# EAGLE design chip-z8530-rs422_split_a (EAGLE 9.3.0)
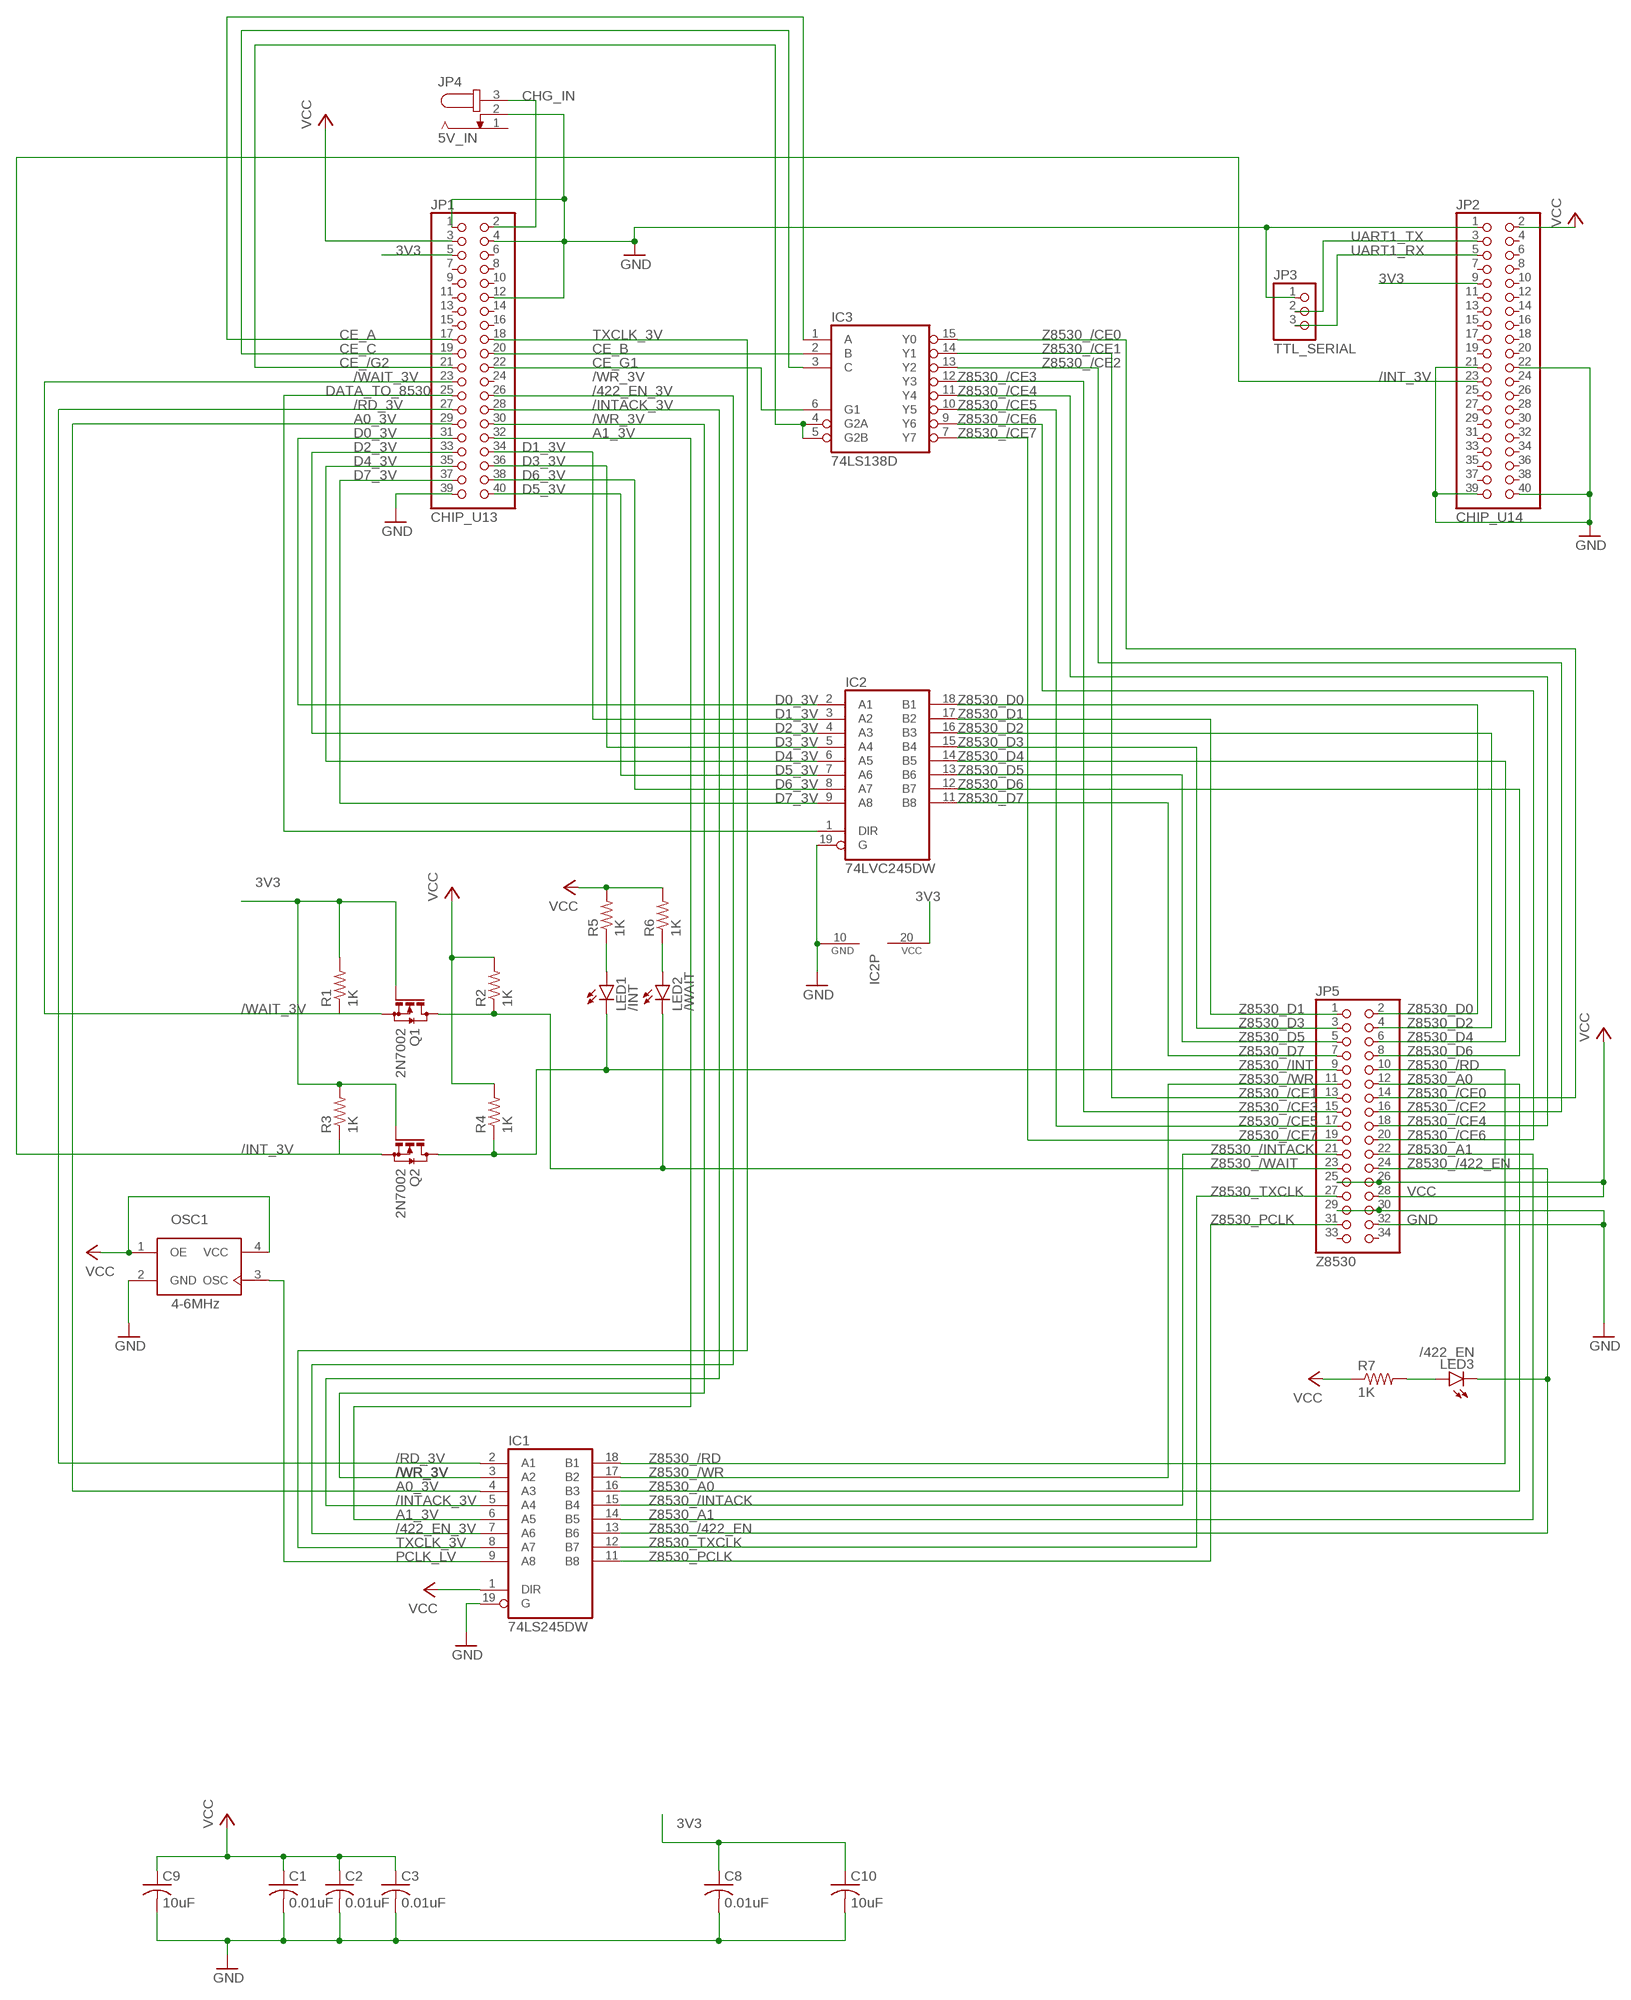
[diagram p0: schematic, sheet 1]

## Parts
C1  0.01uF  C-USC0805  [C0805]
C2  0.01uF  C-USC0805  [C0805]
C3  0.01uF  C-USC0805  [C0805]
C8  0.01uF  C-USC0805  [C0805]
C9  10uF  C-USC0805  [C0805]
C10  10uF  C-USC0805  [C0805]
IC1  74LS245DW  [SO20W]
IC2  74LVC245DW  74LS245DW  [SO20W]
IC3  74LS138D  [SO16]
JP1  CHIP_U13  PINHD-2X20  [2X20]
JP2  CHIP_U14  PINHD-2X20  [2X20]
JP3  TTL_SERIAL  PINHD-1X3/90  [1X03/90]
JP4  5V_IN  JACK-PLUG1  [SPC4078]
JP5  Z8530  PINHD-2X17  [2X17]
LED1  /INT  LED3MM  [LED3MM]
LED2  /WAIT  LED3MM  [LED3MM]
LED3  /422_EN  LED3MM  [LED3MM]
OSC1  4-6MHz  XO-SMD  [SG5032]
Q1  2N7002  BSS123  [SOT23]
Q2  2N7002  BSS123  [SOT23]
R1  1K  R-US_R0805  [R0805]
R2  1K  R-US_R0805  [R0805]
R3  1K  R-US_R0805  [R0805]
R4  1K  R-US_R0805  [R0805]
R5  1K  R-US_R0805  [R0805]
R6  1K  R-US_R0805  [R0805]
R7  1K  R-US_R0805  [R0805]

## Nets
3V3 [3Vpwr]: C8.1 C10.1 IC2.20(VCC) JP1.5 JP2.9 Q1.1(G) Q2.1(G) R1.2 R3.2
/422_EN_3V: IC1.7(A6) JP1.26
/INT_3V: JP2.23 Q2.2(S) R3.1
/INTACK_3V: IC1.5(A4) JP1.28
/RD_3V: IC1.2(A1) JP1.27
/WAIT_3V: JP1.23 Q1.2(S) R1.1
/WR_3V: IC1.3(A2) JP1.30
A0_3V: IC1.4(A3) JP1.29
A1_3V: IC1.6(A5) JP1.32
CE_/G2: IC3.4(G2A) IC3.5(G2B) JP1.21
CE_A: IC3.1(A) JP1.17
CE_B: IC3.2(B) JP1.20
CE_C: IC3.3(C) JP1.19
CE_G1: IC3.6(G1) JP1.22
CHG_IN [gnd]: JP1.2 JP4.3
D0_3V: IC2.2(A1) JP1.31
D1_3V: IC2.3(A2) JP1.34
D2_3V: IC2.4(A3) JP1.33
D3_3V: IC2.5(A4) JP1.36
D4_3V: IC2.6(A5) JP1.35
D5_3V: IC2.7(A6) JP1.40
D6_3V: IC2.8(A7) JP1.38
D7_3V: IC2.9(A8) JP1.37
DATA_TO_8530: IC2.1(DIR) JP1.25
GND [gnd]: C1.2 C2.2 C3.2 C8.2 C9.2 C10.2 IC1.19(G) IC2.10(GND) IC2.19(G) JP1.1 JP1.4 JP1.12 JP1.39 JP2.1 JP2.21 JP2.22 JP2.39 JP2.40 JP3.1 JP4.2 JP5.29 JP5.30 JP5.32 OSC1.2(GND)
N$1: LED1.A R5.1
N$2: LED2.A R6.1
N$3: LED3.A R7.2
PCLK_LV: IC1.9(A8) OSC1.3(OSC)
TXCLK_3V: IC1.8(A7) JP1.18
UART1_RX: JP2.5 JP3.3
UART1_TX: JP2.3 JP3.2
VCC [5Vpwr]: C1.1 C2.1 C3.1 C9.1 IC1.1(DIR) JP1.3 JP2.2 JP5.25 JP5.26 JP5.28 OSC1.1(OE) OSC1.4(VCC) R2.2 R4.2 R5.2 R6.2 R7.1
Z8530_/422_EN: IC1.13(B6) JP5.24 LED3.K(C)
Z8530_/CE0: IC3.15(Y0) JP5.14
Z8530_/CE1: IC3.14(Y1) JP5.13
Z8530_/CE2: IC3.13(Y2) JP5.16
Z8530_/CE3: IC3.12(Y3) JP5.15
Z8530_/CE4: IC3.11(Y4) JP5.18
Z8530_/CE5: IC3.10(Y5) JP5.17
Z8530_/CE6: IC3.9(Y6) JP5.20
Z8530_/CE7: IC3.7(Y7) JP5.19
Z8530_/INT: JP5.9 LED1.K(C) Q2.3(D) R4.1
Z8530_/INTACK: IC1.15(B4) JP5.21
Z8530_/RD: IC1.18(B1) JP5.10
Z8530_/WAIT: JP5.23 LED2.K(C) Q1.3(D) R2.1
Z8530_/WR: IC1.17(B2) JP5.11
Z8530_A0: IC1.16(B3) JP5.12
Z8530_A1: IC1.14(B5) JP5.22
Z8530_D0: IC2.18(B1) JP5.2
Z8530_D1: IC2.17(B2) JP5.1
Z8530_D2: IC2.16(B3) JP5.4
Z8530_D3: IC2.15(B4) JP5.3
Z8530_D4: IC2.14(B5) JP5.6
Z8530_D5: IC2.13(B6) JP5.5
Z8530_D6: IC2.12(B7) JP5.8
Z8530_D7: IC2.11(B8) JP5.7
Z8530_PCLK: IC1.11(B8) JP5.31
Z8530_TXCLK: IC1.12(B7) JP5.27
Unconnected: JP1.6 JP1.7 JP1.8 JP1.9 JP1.10 JP1.11 JP1.13 JP1.14 JP1.15 JP1.16 JP1.24 JP2.4 JP2.6 JP2.7 JP2.8 JP2.10 JP2.11 JP2.12 JP2.13 JP2.14 JP2.15 JP2.16 JP2.17 JP2.18 JP2.19 JP2.20 JP2.24 JP2.25 JP2.26 JP2.27 JP2.28 JP2.29 JP2.30 JP2.31 JP2.32 JP2.33 JP2.34 JP2.35 JP2.36 JP2.37 JP2.38 JP4.1 JP5.33 JP5.34

## Power pins joined to a net without a drawn wire
GND: IC1.10(GND) IC3.8(GND)
VCC: IC1.20(VCC) IC3.16(VCC)

## Library data of the parts
C1-C3 C8-C10 = rcl:C-US: CAPACITOR, American symbol; SPICEPREFIX: C
IC1 IC2 = 74xx-us:74*245: Octal BUS TRANSCEIVER, 3-state
IC3 = 74xx-us:74*138: 3-line to 8-line DECODER/DEMULTIPLEXER
JP1 JP2 = pinhead:PINHD-2X20: PIN HEADER
JP3 = pinhead:PINHD-1X3: PIN HEADER
JP4 = con-jack:JACK-PLUG: DC POWER JACK Power Jack, DC, Right Angle, Through Hole, Rated 5A at 16VDC, PC Terminals Distributor: Farnell (www.Farnell.de) Drawing: 84N1161.pdf / 84N1162.pdf Manufacturer: SPC Technology (www.spctechnology.com) Type: SPC4077 / SPC 4078; OC_FARNELL: unknown; OC_NEWARK: unknown
JP5 = pinhead:PINHD-2X17: PIN HEADER
LED1-LED3 = led:LED: LED OSRAM: - CHIPLED LG R971, LG N971, LY N971, LG Q971, LY Q971, LO R971, LY R971 LH N974, LH R974 LS Q976, LO Q976, LY Q976 LO Q996 - Hyper CHIPLED LW Q18S LB Q993, LB Q99A, LB R99A - SideLED LS A670, LO A670, LY A670, LG A670, LP A670 LB A673, LV A673, LT A673, LW A673 LH A674 LY A675 LS A676, LA A676, LO A676, LY A676, LW A676 LS A679, LY A679, LG A679 - Hyper Micro SIDELED® LS Y876, LA Y876, LO Y876, LY Y876 LT Y87S - SmartLED LW L88C, LW L88S LB L89C, LB L89S, LG L890 LS L89K, LO L89K, LY L89K LS L896, LA L896, LO L896, LY L896 - TOPLED LS T670, LO T670, LY T670, LG T670, LP T670 LSG T670, LSP T670, LSY T670, LOP T670, LYG T670 LG T671, LOG T671, LSG T671 LB T673, LV T673, LT T673, LW T673 LH T674 LS T676, LA T676, LO T676, LY T676, LB T676, LH T676, LSB T676, LW T676 LB T67C, LV T67C, LT T67C, LS T67K, LO T67K, LY T67K, LW E67C LS E67B, LA E67B, LO E67B, LY E67B, LB E67C, LV E67C, LT E67C LW T67C LS T679, LY T679, LG T679 LS T770, LO T770, LY T770, LG T770, LP T770 LB T773, LV T773, LT T773, LW T773 LH T774 LS E675, LA E675, LY E675, LS T675 LS T776, LA T776, LO T776, LY T776, LB T776 LHGB T686 LT T68C, LB T68C - Hyper Mini TOPLED® LB M676 - Mini TOPLED Santana® LG M470 LS M47K, LO M47K, LY M47K Source: http://www.osram.convergy.de LUXEON: - LUMILED® LXK2-PW12-R00, LXK2-PW12-S00, LXK2-PW14-U00, LXK2-PW14-V00 LXK2-PM12-R00, LXK2-PM12-S00, LXK2-PM14-U00 LXK2-PE12-Q00, LXK2-PE12-R00, LXK2-PE12-S00, LXK2-PE14-T00, LXK2-PE14-U00 LXK2-PB12-K00, LXK2-PB12-L00, LXK2-PB12-M00, LXK2-PB14-N00, LXK2-PB14-P00, LXK2-PB14-Q00 LXK2-PR12-L00, LXK2-PR12-M00, LXK2-PR14-Q00, LXK2-PR14-R00 LXK2-PD12-Q00, LXK2-PD12-R00, LXK2-PD12-S00 LXK2-PH12-R00, LXK2-PH12-S00 LXK2-PL12-P00, LXK2-PL12-Q00, LXK2-PL12-R00 Source: www.luxeon.com KINGBRIGHT: KA-3528ASYC Source: www.kingbright.com
OSC1 = rs422-stuff:XO-SMD: Surface mount xtal oscillator in SG5032 package
Q1 Q2 = transistor-small-signal:BSS123: N-CHANNEL MOS FET
R1-R7 = rcl:R-US_: RESISTOR, American symbol; SPICEPREFIX: R

## Net classes
0 default: width 0.254 mm, clearance 0.254 mm
1 3Vpwr: width 0.305 mm, clearance 0.254 mm
2 5Vpwr: width 0.406 mm, clearance 0.254 mm
3 gnd: width 0.508 mm, clearance 0.254 mm

## Board
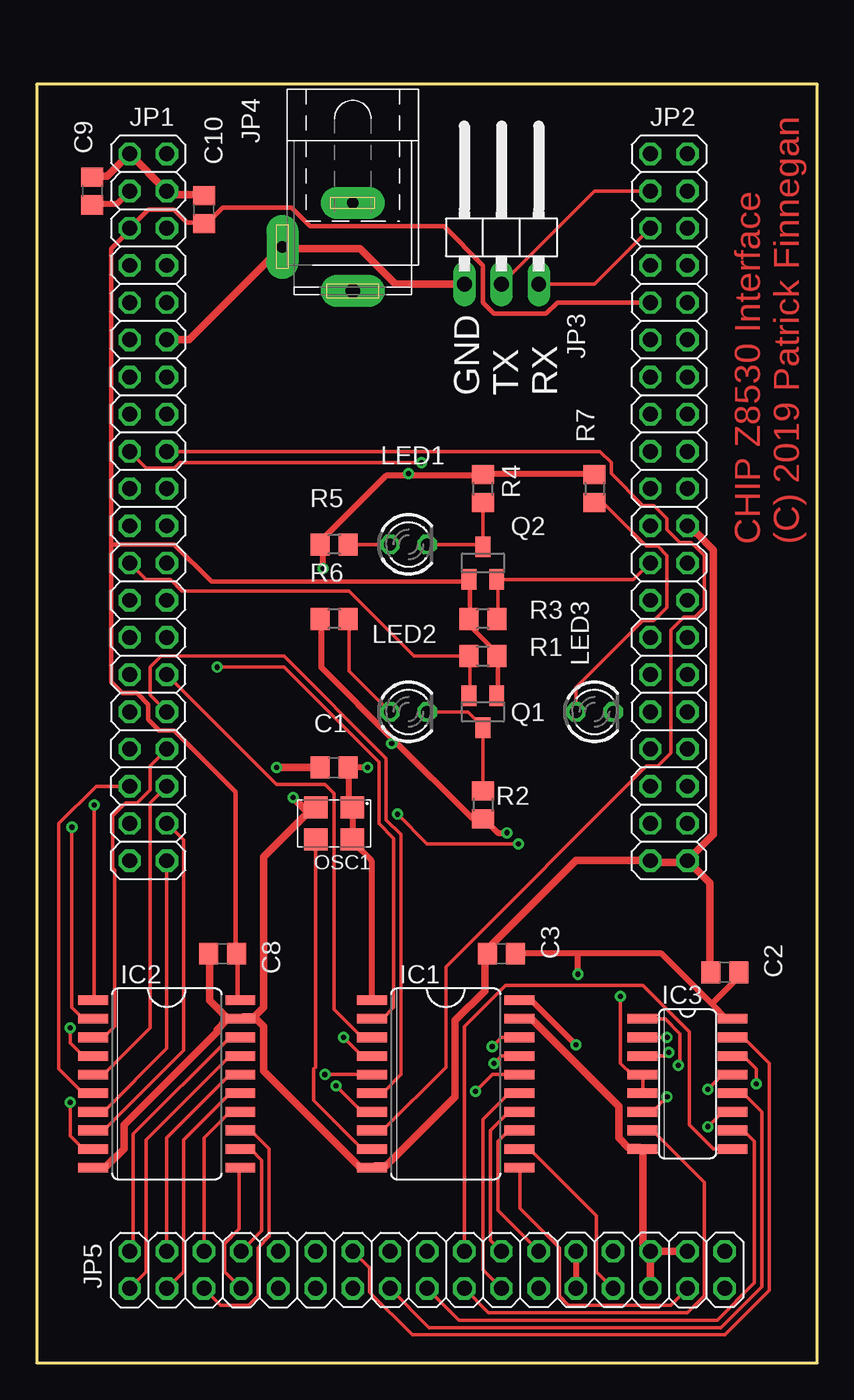
[diagram p1: board, top side]
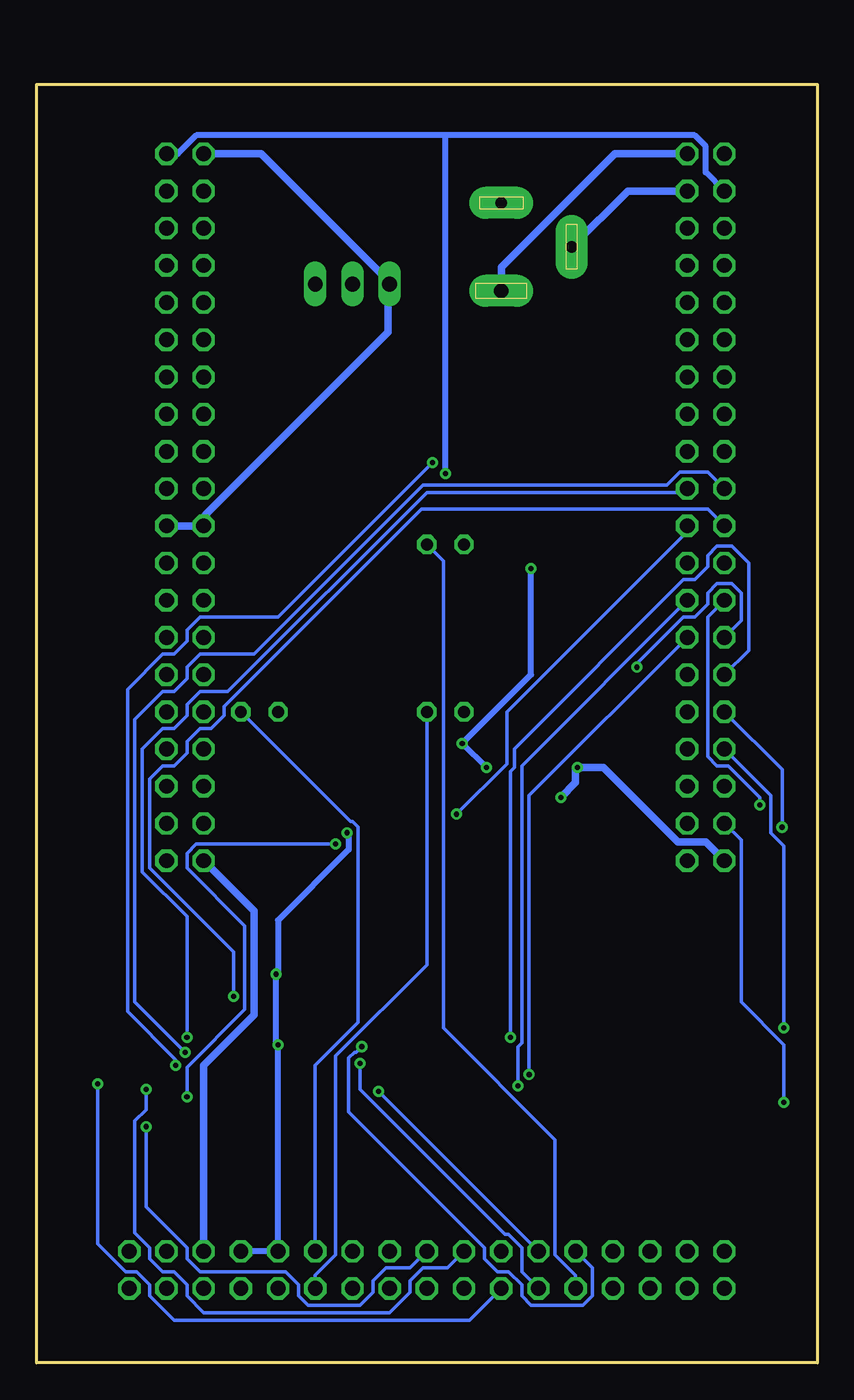
[diagram p2: board, bottom side, seen from below]

Size 53.32 x 87.3 mm. Coordinates in mm from the lower left corner, seen from the top.
Outline: 0,0 53.32,0 53.32,87.3 0,87.3 0,0
Copper layers (1*16): Top 0.035mm / dielectric 1.5mm / Bottom 0.035mm
Design rules "8mil": minimum track width 6mil, minimum drill 0.35mm, track to track 8mil, track to pad 8mil, pad to pad 8mil, via to via 8mil, smd to smd 8mil, copper to edge 40mil, drill to drill 6mil, minimum pad ring 10mil, minimum via ring 8mil, stop-mask expansion 4mil, vias tented up to drill 0mil, thermal gap 10mil

### Footprints (pad centres in the part's own frame; a part is rotated, then mirrored left to right if it is on the bottom)
C0805 = smd 1.3 x 1.5: 1 -0.95,0; 2 0.95,0
SO20W = smd 0.66 x 2.032: 1 -5.715,-5.029; 2 -4.445,-5.029; 3 -3.175,-5.029; 4 -1.905,-5.029; 5 -0.635,-5.029; 6 0.635,-5.029; 7 1.905,-5.029; 8 3.175,-5.029; 9 4.445,-5.029; 10 5.715,-5.029; 11 5.715,5.029; 12 4.445,5.029; 13 3.175,5.029; 14 1.905,5.029; 15 0.635,5.029; 16 -0.635,5.029; 17 -1.905,5.029; 18 -3.175,5.029; 19 -4.445,5.029; 20 -5.715,5.029
SO16 = smd 0.66 x 2.032: 1 -4.445,-3.073; 2 -3.175,-3.073; 3 -1.905,-3.073; 4 -0.635,-3.073; 5 0.635,-3.073; 6 1.905,-3.073; 7 3.175,-3.073; 8 4.445,-3.073; 9 4.445,3.073; 10 3.175,3.073; 11 1.905,3.073; 12 0.635,3.073; 13 -0.635,3.073; 14 -1.905,3.073; 15 -3.175,3.073; 16 -4.445,3.073
2X20 = drill 1.016 octagon: 1 -24.13,-1.27; 2 -24.13,1.27; 3 -21.59,-1.27; 4 -21.59,1.27; 5 -19.05,-1.27; 6 -19.05,1.27; 7 -16.51,-1.27; 8 -16.51,1.27; 9 -13.97,-1.27; 10 -13.97,1.27; 11 -11.43,-1.27; 12 -11.43,1.27; 13 -8.89,-1.27; 14 -8.89,1.27; 15 -6.35,-1.27; 16 -6.35,1.27; 17 -3.81,-1.27; 18 -3.81,1.27; 19 -1.27,-1.27; 20 -1.27,1.27; 21 1.27,-1.27; 22 1.27,1.27; 23 3.81,-1.27; 24 3.81,1.27; 25 6.35,-1.27; 26 6.35,1.27; 27 8.89,-1.27; 28 8.89,1.27; 29 11.43,-1.27; 30 11.43,1.27; 31 13.97,-1.27; 32 13.97,1.27; 33 16.51,-1.27; 34 16.51,1.27; 35 19.05,-1.27; 36 19.05,1.27; 37 21.59,-1.27; 38 21.59,1.27; 39 24.13,-1.27; 40 24.13,1.27
1X03/90 = drill 1.016 long: 1 -2.54,-3.81; 2 0,-3.81; 3 2.54,-3.81
SPC4078 = drill 0.8 pad 2.184 long: 1 -3,0; 2 0,-4.8 | drill 1 pad 2.184 long: 3 3,0
2X17 = drill 1.016 octagon: 1 -20.32,-1.27; 2 -20.32,1.27; 3 -17.78,-1.27; 4 -17.78,1.27; 5 -15.24,-1.27; 6 -15.24,1.27; 7 -12.7,-1.27; 8 -12.7,1.27; 9 -10.16,-1.27; 10 -10.16,1.27; 11 -7.62,-1.27; 12 -7.62,1.27; 13 -5.08,-1.27; 14 -5.08,1.27; 15 -2.54,-1.27; 16 -2.54,1.27; 17 0,-1.27; 18 0,1.27; 19 2.54,-1.27; 20 2.54,1.27; 21 5.08,-1.27; 22 5.08,1.27; 23 7.62,-1.27; 24 7.62,1.27; 25 10.16,-1.27; 26 10.16,1.27; 27 12.7,-1.27; 28 12.7,1.27; 29 15.24,-1.27; 30 15.24,1.27; 31 17.78,-1.27; 32 17.78,1.27; 33 20.32,-1.27; 34 20.32,1.27
LED3MM = drill 0.813 octagon: A -1.27,0; K 1.27,0
SG5032 = smd 1.6 x 1.5: 1 -1.25,-1.1; 2 1.25,-1.1; 3 1.25,1.1; 4 -1.25,1.1
SOT23 = smd 1 x 1.4: 1 -0.95,-1.1; 2 0.95,-1.1; 3 0,1.1
R0805 = smd 1.3 x 1.5: 1 -0.95,0; 2 0.95,0

### Placement (x,y rotation side)
C1  20.32,40.64 180 top
C2  46.99,26.67 180 top
C3  31.75,27.94 180 top
C8  12.7,27.94 180 top
C9  3.81,80.01 90 top
C10  11.43,78.74 90 top
IC1  27.94,19.05 270 top
IC2  8.89,19.05 270 top
IC3  44.45,19.05 270 top
JP1  7.62,58.42 270 top
JP2  43.18,58.42 270 top
JP3  31.75,77.47 0 top
JP4  21.59,76.2 270 top
JP5  26.67,6.35 0 top
LED1  25.4,55.88 0 top
LED2  25.4,44.45 0 top
LED3  38.1,44.45 0 top
OSC1  20.32,36.83 180 top
Q1  30.48,44.45 180 top
Q2  30.48,54.61 0 top
R1  30.48,48.26 0 top
R2  30.48,38.1 270 top
R3  30.48,50.8 180 top
R4  30.48,59.69 90 top
R5  20.32,55.88 180 top
R6  20.32,50.8 180 top
R7  38.1,59.69 270 top

### Tracks (layer width: path | path; a pad name or v marks a point on that pad's centre or on a via)
3V3
  Top 0.305: Q1.1 31.5,45.59 31.5,48.26 R1.2 31.5,48.39 29.59,50.29 29.59,50.67 R3.2 29.59,50.8 29.59,53.47 Q2.1 29.46,53.34 11.94,53.34 9.4,55.88 5.08,55.88 | IC2.20 13.84,24.77 13.72,24.89 13.72,27.94 C8.1 13.59,28.07 13.59,38.99 9.4,43.18 8.38,43.18 7.62,43.94 7.62,44.96 6.86,45.72 5.84,45.72 5.08,46.48 5.08,55.88 | 5.08,55.88 5.08,76.07 6.35,77.34 JP1.5 7.62,78.74 9.4,78.74 10.29,77.85 11.43,77.85 C10.1 11.56,77.72 12.7,78.87 17.4,78.87 18.67,77.6 27.81,77.6 30.48,74.93 30.48,72.39 31.24,71.63 34.8,71.63 35.56,72.39 JP2.9
/422_EN_3V  (via drill 0.35)
  Top 0.254: IC1.7 22.23,17.14 v20.45,18.92
  Bottom 0.254: v20.45,18.92 20.45,21.59 20.19,21.84 20.19,40.77 JP1.26
/INT_3V
  Top 0.254: R3.1 31.5,50.8 31.5,53.47 Q2.2 31.62,53.47 40.77,53.47 JP2.23
/INTACK_3V  (via drill 0.35)
  Top 0.254: v19.69,19.68 IC1.5
  Bottom 0.254: v19.69,19.68 19.69,38.73 JP1.28
/RD_3V  (via drill 0.35)
  Top 0.254: IC1.2 23.62,23.49 24.38,24.26 24.38,35.81 23.37,36.83 23.37,41.02 16.89,47.5 v12.32,47.5
  Bottom 0.254: v12.32,47.5 12.32,47.75 9.14,50.93 8.38,50.93 7.49,51.82 7.49,52.58 6.86,53.21 5.84,53.21 5.21,52.58 5.21,50.67 JP1.27
/WAIT_3V
  Top 0.254: Q1.2 29.59,45.59 29.59,48.26 R1.1 25.78,48.26 21.34,52.71 9.91,52.71 9.14,53.47 7.49,53.47 JP1.23
/WR_3V
  Top 0.254: IC1.3 22.23,22.23 20.32,24.13 20.32,38.86 19.69,39.5 16.38,39.5 JP1.30
A0_3V  (via drill 0.35)
  Top 0.254: IC1.4 22.23,20.95 v20.95,22.23
  Bottom 0.254: v20.95,22.23 20.95,40.39 20.7,40.64 20.7,41.91 9.14,53.47 8.38,53.47 7.49,54.36 7.49,55.12 6.86,55.75 5.84,55.75 4.7,54.61 4.7,48.64 JP1.29
A1_3V
  Top 0.254: IC1.6 23.62,18.41 24.89,19.68 24.89,36.07 23.88,37.08 23.88,41.27 16.89,48.26 8.51,48.26 7.75,47.5 7.75,45.59 JP1.32
CE_/G2  (via drill 0.35)
  Top 0.254: IC3.5 41.4,18.41 41.4,19.68 IC3.4 40.64,19.68 39.88,20.45 v39.88,25.02
  Bottom 0.254: v39.88,25.02 39.88,28.07 45.59,33.78 45.59,39.88 44.7,40.77 43.94,40.77 43.05,41.66 43.05,42.42 42.16,43.31 41.4,43.31 40.51,44.2 40.51,44.83 27.05,58.29 7.49,58.29 JP1.21
CE_A  (via drill 0.35)
  Top 0.254: IC3.1 42.93,23.49 43.94,22.48 43.94,20.45 v43.81,20.32 | v26.29,61.47 9.78,61.47 9.4,61.09 7.49,61.09 JP1.17
  Bottom 0.254: v43.81,20.32 43.81,20.7 47.12,24 47.12,45.97 44.7,48.39 43.94,48.39 43.05,49.28 43.05,50.04 42.16,50.93 36.83,50.93 v26.29,61.47
CE_B  (via drill 0.35)
  Top 0.254: v43.05,22.23 IC3.2
  Bottom 0.254: v43.05,22.23 43.05,30.48 46.1,33.53 46.1,41.91 44.7,43.31 43.94,43.31 43.05,44.2 43.05,44.96 42.16,45.85 40.26,45.85 26.67,59.44 9.14,59.44 JP1.20
CE_C  (via drill 0.35)
  Top 0.254: IC3.3 42.93,20.95 v43.18,21.21
  Bottom 0.254: v43.18,21.21 46.61,24.64 46.61,43.94 44.7,45.85 43.94,45.85 43.05,46.74 43.05,47.5 42.16,48.39 38.48,48.39 26.92,59.94 10.29,59.94 9.4,60.83 7.49,60.83 JP1.19
CE_G1  (via drill 0.35)
  Top 0.254: IC3.6 42.04,17.14 v43.05,18.16 | v32.89,35.43 26.67,35.43 v24.64,37.47
  Bottom 0.254: v43.05,18.16 43.05,20.19 39.12,24.13 39.12,29.84 43.05,33.78 43.05,34.8 42.42,35.43 v32.89,35.43 | v24.64,37.47 21.21,40.89 21.21,44.45 8.89,56.77 JP1.22
CHG_IN
  Bottom 0.508: JP1.2 13.84,82.55 21.59,74.8 JP4.3
D0_3V  (via drill 0.35)
  Top 0.254: IC2.2 3.18,23.49 2.41,24.26 v2.41,36.58
  Bottom 0.254: v2.41,36.58 2.41,40.51 JP1.31
D1_3V
  Top 0.254: IC2.3 4.57,22.23 5.33,22.99 5.33,33.66 5.21,33.78 5.21,37.34 6.1,38.23 6.86,38.23 7.75,39.12 7.75,40.77 JP1.34
D2_3V  (via drill 0.35)
  Top 0.254: IC2.4 3.18,20.95 2.29,21.84 v2.29,22.86
  Bottom 0.254: v2.29,22.86 2.29,35.31 3.18,36.2 3.18,38.73 JP1.33
D3_3V
  Top 0.254: IC2.5 4.57,19.68 7.75,22.86 7.75,38.23 JP1.36
D4_3V
  Top 0.254: IC2.6 3.18,18.41 1.52,20.07 1.52,36.83 4.06,39.37 JP1.35
D5_3V
  Top 0.254: IC2.7 4.57,17.14 8.89,21.46 JP1.40
D6_3V
  Top 0.254: IC2.8 4.57,15.88 10.03,21.34 10.03,35.69 JP1.38
D7_3V  (via drill 0.35)
  Top 0.254: IC2.9 3.18,14.61 2.29,15.49 v2.29,17.78
  Bottom 0.254: v2.29,17.78 2.29,21.72 5.21,24.64 5.21,35.69 JP1.37
DATA_TO_8530  (via drill 0.35)
  Top 0.254: v3.94,38.1 3.94,24.77 IC2.1
  Bottom 0.254: v3.94,38.1 3.94,38.61 6.1,40.77 6.86,40.77 7.49,41.4 7.49,50.93 JP1.25
GND  (via drill 0.35)
  Top 0.508: C10.2 11.43,79.76 9.14,79.76 JP1.4 JP1.1 4.83,81.03 3.81,81.03 C9.2 | JP1.12 10.41,69.85 16.76,76.2 JP4.2 17.02,76.07 22.1,76.07 24.51,73.66 JP3.1 | JP5.30 41.4,8.13 41.4,14.61 IC3.8 41.15,14.73 40.39,14.73 39.75,15.37 39.75,17.53 33.78,23.49 IC1.19 | JP5.30 JP5.29 | JP5.30 JP5.32 | JP2.40 45.97,32.77 45.97,26.67 C2.2 | JP2.40 44.32,34.16 42.04,34.16 JP2.39 36.83,34.29 30.86,28.32 30.86,27.94 C3.2 30.61,27.81 30.61,25.4 28.57,23.37 28.57,18.16 23.88,13.46 23.11,13.46 IC1.10 22.1,13.34 15.49,19.94 15.49,22.99 14.86,23.62 | v16.38,40.64 C1.2 | IC2.19 13.08,23.49 11.81,24.77 11.81,27.94 C8.2 | 14.86,23.62 15.49,24.26 15.49,34.54 18.8,37.85 19.05,37.85 OSC1.2 18.41,37.72 v17.53,38.61 | 14.86,23.62 14.1,23.62 IC2.19 | IC2.10 4.7,13.34 5.97,14.61 5.97,16.26 12.32,22.61 12.32,22.73 12.95,23.37 IC2.19 | JP2.22 44.96,56.64 45.09,56.64 46.23,55.5 46.23,36.07 JP2.40
  Bottom 0.508: JP2.22 JP2.21 41.78,57.28 41.78,57.91 29.34,70.36 29.34,73.53 JP3.1 29.21,73.79 37.97,82.55 JP2.1 | JP1.4 12.95,80.01 16.76,76.2 JP4.2 | JP1.39 7.62,35.56 9.53,35.56 14.6,40.64 v16.38,40.64 16.51,40.51 16.51,39.62 v17.53,38.61 | JP5.30 41.91,20.32 38.48,23.75 38.48,30.86 JP2.39
N$1
  Top 0.254: LED1.A R5.1
N$2
  Top 0.254: LED2.A 21.34,47.24 21.34,50.8 R6.1
N$3
  Top 0.254: LED3.A 36.83,46.1 41.4,50.67 42.16,50.67 43.05,51.56 43.05,55.12 42.42,55.75 41.66,55.75 38.73,58.67 38.1,58.67 R7.2
PCLK_LV
  Top 0.254: IC1.9 22.23,14.61 18.92,17.91 18.92,20.07 19.05,20.19 19.05,35.69 OSC1.3
TXCLK_3V
  Top 0.254: IC1.8 23.62,15.88 27.94,20.19 27.94,27.05 41.66,40.77 42.42,40.77 43.31,41.66 43.31,50.04 44.2,50.93 44.96,50.93 45.59,51.56 45.59,55.12 44.7,56.01 43.94,56.01 43.05,56.9 43.05,57.66 42.16,58.55 41.4,58.55 39.24,60.71 39.24,61.47 38.48,62.23 JP1.18
UART1_RX
  Top 0.254: JP3.3 38.1,73.66 JP2.5
UART1_TX
  Top 0.254: JP3.2 38.1,80.01 JP2.3
VCC  (via drill 0.35)
  Top 0.406: JP1.3 5.46,79.12 3.81,79.12 C9.1 | 36.96,27.94 42.67,27.94 46.1,24.51 | 36.96,27.94 C3.1 | 46.1,24.51 47.12,23.49 IC3.16 | 46.1,24.51 47.88,26.29 47.88,26.67 C2.1 | IC1.20 33.78,24.77 v36.83,21.72 | JP5.26 JP5.25 | v36.96,26.54 36.96,27.94 | 25.4,60.58 30.48,60.58 R4.2 30.61,60.71 38.1,60.71 R7.1 | 25.4,60.58 23.88,60.58 19.43,56.13 19.43,55.88 R5.2 19.56,55.75 v19.56,54.23 | IC1.1 22.86,24.77 22.86,34.29 21.59,35.56 OSC1.4 21.59,35.81 21.59,37.72 OSC1.1 21.46,37.97 21.34,38.1 21.34,40.64 C1.1 v22.61,40.64 | 24.38,42.55 19.43,47.5 19.43,50.8 R6.2 | 24.38,42.55 29.72,37.21 30.48,37.21 R2.2 30.61,37.08 31.5,36.2 v32.13,36.2 | v24.26,42.29 24.26,42.42 24.38,42.55 | v25.4,60.71 25.4,60.58
  Bottom 0.406: JP2.2 43.69,82.55 42.42,83.82 25.4,83.82 | 25.4,83.82 8.38,83.82 7.62,83.06 7.62,81.28 JP1.3 | JP5.28 JP5.26 v36.83,21.72 36.96,21.84 v36.96,26.54 36.83,26.67 36.83,30.23 32,35.05 32,36.07 v32.13,36.2 | v22.61,40.64 v24.26,42.29 19.56,46.99 v19.56,54.23 | v25.4,60.71 25.4,83.82
Z8530_/422_EN
  Top 0.254: IC1.13 32.26,15.88 31.5,15.11 31.5,10.41 JP5.24
  Bottom 0.254: LED3.K 31.88,36.96 31.75,36.96 31.37,36.58 31.37,23.24 34.29,20.32 JP5.24
Z8530_/CE0
  Top 0.254: IC3.15 48.26,22.23 50.04,20.45 50.04,4.95 46.99,1.91 25.65,1.91 22.73,4.83 22.73,6.48 JP5.14
Z8530_/CE1  (via drill 0.35)
  Top 0.254: IC3.14 48.26,20.95 49.15,20.07 v49.15,19.05
  Bottom 0.254: v49.15,19.05 49.15,8.13 47.24,6.22 46.48,6.22 45.59,5.33 45.59,4.57 43.94,2.92 23.75,2.92 JP5.13
Z8530_/CE2  (via drill 0.35)
  Top 0.254: IC3.13 46.86,19.68 v45.85,18.67
  Bottom 0.254: v45.85,18.67 45.85,17.27 46.61,16.51 46.61,8.89 45.59,7.87 45.59,7.11 44.7,6.22 43.94,6.22 43.05,5.33 43.05,4.57 41.91,3.43 29.21,3.43 27.81,4.83 27.81,5.59 26.92,6.48 25.27,6.48 JP5.16
Z8530_/CE3
  Top 0.254: IC3.12 48.26,18.41 49.53,17.14 49.53,5.21 46.74,2.41 26.8,2.41 JP5.15
Z8530_/CE4  (via drill 0.35)
  Top 0.254: IC3.11 46.86,17.14 v45.85,16.13
  Bottom 0.254: v45.85,16.13 45.85,10.67 43.05,7.87 43.05,7.11 42.16,6.22 36.32,6.22 35.43,5.33 35.43,4.57 34.8,3.94 31.24,3.94 30.35,4.83 30.35,5.59 29.46,6.48 27.81,6.48 JP5.18
Z8530_/CE5
  Top 0.254: IC3.10 48.26,15.88 49.02,15.11 49.02,5.46 46.48,2.92 28.83,2.92 JP5.17
Z8530_/CE6
  Top 0.254: IC3.9 46.23,14.61 44.58,16.26 44.58,22.61 41.4,25.78 32,25.78 29.21,22.99 JP5.20
Z8530_/CE7
  Top 0.254: IC3.7 42.04,15.88 45.59,12.32 45.59,4.57 44.45,3.43 30.86,3.43 JP5.19
Z8530_/INT
  Top 0.254: R4.1 30.48,55.88 | 30.48,55.88 Q2.3 30.48,55.75 | LED1.K 30.48,55.88
  Bottom 0.254: JP5.9 16.51,5.97 17.91,7.37 17.91,15.24 25.53,22.86 25.53,54.74 LED1.K
Z8530_/INTACK
  Top 0.254: IC1.15 32.26,18.41 30.48,16.64 30.48,6.35 JP5.21
Z8530_/RD  (via drill 0.35)
  Top 0.254: IC1.18 31.75,22.23 v31.12,21.59
  Bottom 0.254: v31.12,21.59 31.5,21.21 31.62,21.21 32,20.83 32,17.14 22.73,7.87 22.73,7.11 21.84,6.22 21.08,6.22 20.19,5.33 20.19,4.57 19.56,3.94 16,3.94 15.37,4.57 15.37,6.48 JP5.10
Z8530_/WAIT
  Top 0.254: R2.1 Q1.3 30.48,43.43 29.46,44.45 LED2.K
  Bottom 0.254: JP5.23 34.29,5.97 32.89,7.37 32.89,20.95 26.67,27.18 LED2.K
Z8530_/WR  (via drill 0.35)
  Top 0.254: IC1.17 31.75,20.95 v31.24,20.45
  Bottom 0.254: v31.24,20.45 31.24,18.67 21.34,8.76 21.08,8.76 20.19,7.87 20.19,6.22 JP5.11
Z8530_A0  (via drill 0.35)
  Top 0.254: IC1.16 31.12,19.68 v29.97,18.54
  Bottom 0.254: JP5.12 v29.97,18.54
Z8530_A1
  Top 0.254: IC1.14 32.26,17.14 30.99,15.88 30.99,8.38 JP5.22
Z8530_D0
  Top 0.254: IC2.18 13.21,22.23 6.6,15.62 6.6,7.87 JP5.2
Z8530_D1
  Top 0.254: IC2.17 13.21,20.95 7.49,15.24 7.49,6.22 JP5.1
Z8530_D2
  Top 0.254: IC2.16 13.21,19.68 8.89,15.37 JP5.4
Z8530_D3
  Top 0.254: IC2.15 13.21,18.41 10.03,15.24 10.03,6.22 JP5.3
Z8530_D4
  Top 0.254: IC2.14 13.21,17.14 11.43,15.37 JP5.6
Z8530_D5
  Top 0.254: IC2.13 14.6,15.88 15.88,14.61 15.88,8.64 15.11,7.87 15.11,4.57 14.48,3.94 12.57,3.94 JP5.5
Z8530_D6
  Top 0.254: IC2.12 14.6,14.61 15.37,13.84 15.37,9.02 JP5.8
Z8530_D7
  Top 0.254: JP5.7 12.83,6.22 12.83,8.13 13.84,9.14 13.84,13.34 IC2.11
Z8530_PCLK
  Top 0.254: JP5.31 43.31,3.94 36.32,3.94 35.69,4.57 35.69,7.87 33.02,10.54 33.02,13.34 IC1.11
Z8530_TXCLK
  Top 0.254: IC1.12 33.66,14.61 38.23,10.03 38.23,6.22 JP5.27

### Text on the board
Top: CHIP Z8530 Interface / (C) 2019 Patrick Finnegan
tNames: GND / TX / RX